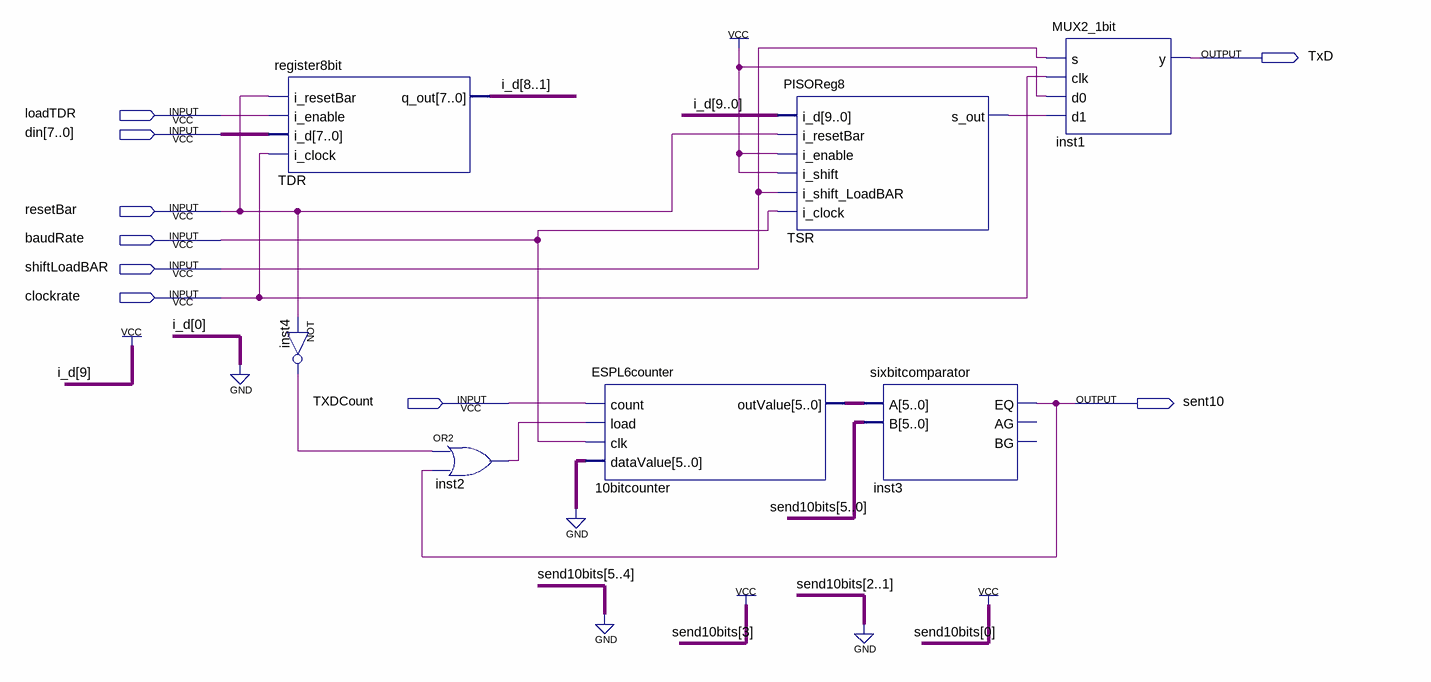
[diagram p0: schematic sheet]
// Quartus schematic transmitterDataFlow.bdf as structural Verilog: 7 symbols, 9 pins
module transmitterDataFlow (
  input  loadTDR,
  input  [7:0] din,
  input  resetBar,
  input  baudRate,
  input  shiftLoadBAR,
  input  clockrate,
  input  TXDCount,
  output TxD,
  output sent10
);

  wire inst2_out, inst4_out, TSR_s_out;
  wire [5:0] n10bitcounter_outvalue;
  wire [8:1] i_d;

  register8bit TDR (.i_resetBar(resetBar), .i_enable(loadTDR), .i_d(din), .i_clock(clockrate), .q_out(i_d));
  not inst4 (inst4_out, resetBar);
  or inst2 (inst2_out, inst4_out, sent10);
  ESPL6counter u_10bitcounter (
    .count(TXDCount), .load(inst2_out), .clk(baudRate), .dataValue({6{1'b0}}),
    .outValue(n10bitcounter_outvalue));
  PISOReg8 TSR (
    .i_d({1'b1, i_d, 1'b0}), .i_resetBar(resetBar), .i_enable(1'b1), .i_shift(1'b1),
    .i_shift_LoadBAR(shiftLoadBAR), .i_clock(baudRate), .s_out(TSR_s_out));
  sixbitcomparator inst3 (.A(n10bitcounter_outvalue), .B(6'b001001), .EQ(sent10));  // open: AG, BG
  MUX2_1bit inst1 (.s(shiftLoadBAR), .clk(clockrate), .d0(1'b1), .d1(TSR_s_out), .y(TxD));
endmodule
